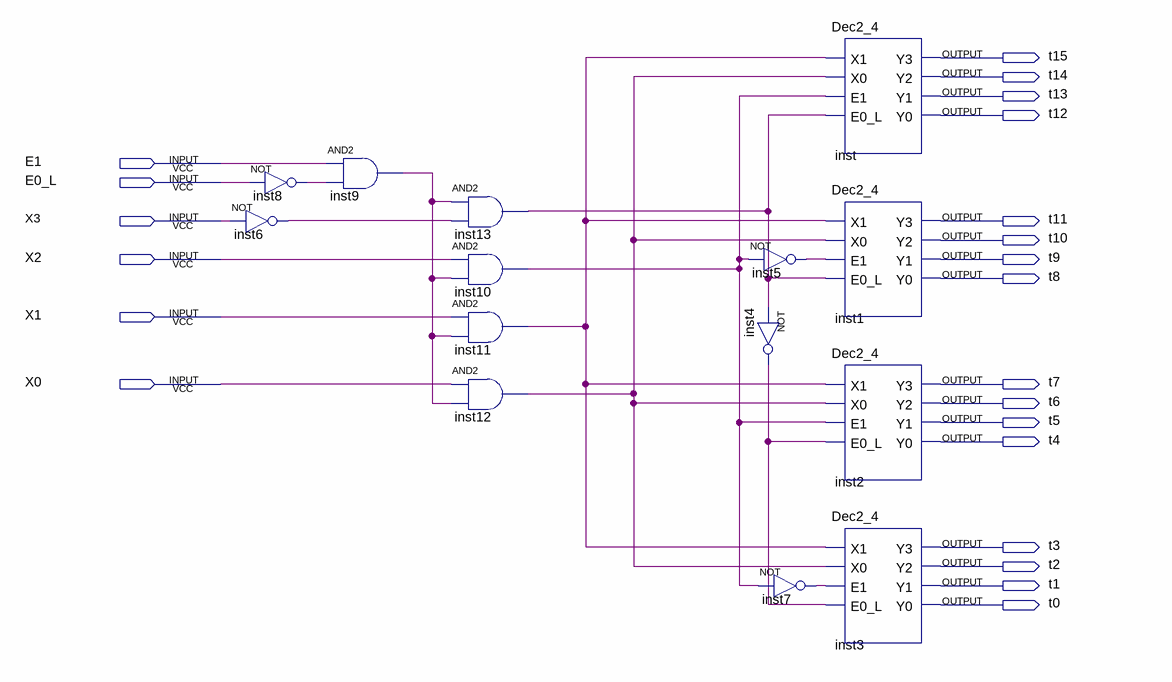
[diagram p0: schematic sheet]
// Quartus schematic Dec4_16.bdf as structural Verilog: 14 symbols, 22 pins
module Dec4_16 (
  input  E1,
  input  E0_L,
  input  X3,
  input  X2,
  input  X1,
  input  X0,
  output t15,
  output t14,
  output t13,
  output t12,
  output t11,
  output t10,
  output t9,
  output t8,
  output t7,
  output t6,
  output t5,
  output t4,
  output t3,
  output t2,
  output t1,
  output t0
);

  wire inst4_out, inst5_out, inst6_out, inst7_out, inst8_out, inst9_out, inst10_out, inst11_out, inst12_out,
       inst13_out;

  not inst6 (inst6_out, X3);
  not inst8 (inst8_out, E0_L);
  and inst9 (inst9_out, E1, inst8_out);
  and inst13 (inst13_out, inst9_out, inst6_out);
  and inst10 (inst10_out, X2, inst9_out);
  and inst11 (inst11_out, X1, inst9_out);
  and inst12 (inst12_out, X0, inst9_out);
  not inst5 (inst5_out, inst10_out);
  not inst4 (inst4_out, inst13_out);
  not inst7 (inst7_out, inst10_out);
  Dec2_4 inst (
    .X1(inst11_out), .X0(inst12_out), .E1(inst10_out), .E0_L(inst13_out), .Y3(t15), .Y2(t14), .Y1(t13),
    .Y0(t12));
  Dec2_4 inst1 (
    .X1(inst11_out), .X0(inst12_out), .E1(inst5_out), .E0_L(inst13_out), .Y3(t11), .Y2(t10), .Y1(t9), .Y0(t8));
  Dec2_4 inst2 (
    .X1(inst11_out), .X0(inst12_out), .E1(inst10_out), .E0_L(inst4_out), .Y3(t7), .Y2(t6), .Y1(t5), .Y0(t4));
  Dec2_4 inst3 (.X1(inst11_out), .X0(inst12_out), .E1(inst7_out), .E0_L(inst4_out), .Y3(t3), .Y2(t2), .Y1(t1), .Y0(t0));
endmodule
